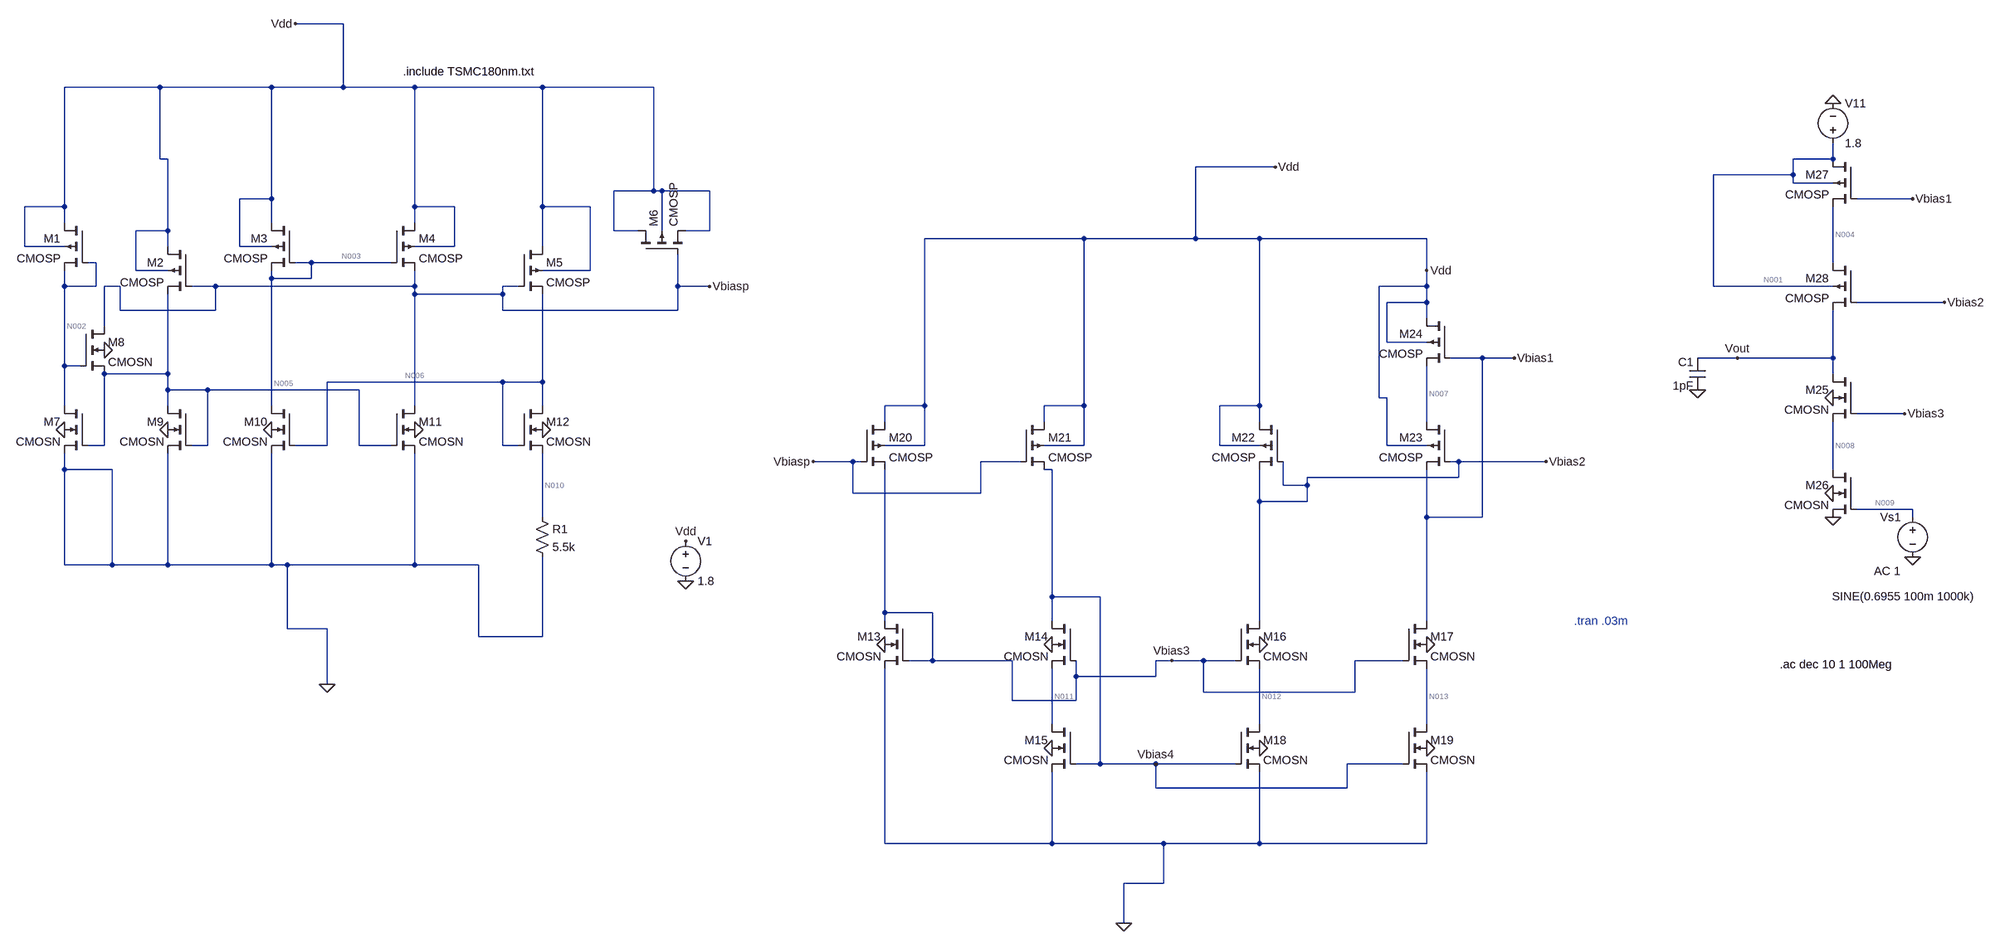
[diagram p0: schematic Project_LTSPICE_180nm.asc]
Project_LTSPICE_180nm.asc, the LTspice schematic file:
Version 4
SHEET 1 5252 1396
WIRE 96 -432 0 -432
WIRE -272 -304 -464 -304
WIRE -48 -304 -272 -304
WIRE 96 -304 96 -432
WIRE 96 -304 -48 -304
WIRE 240 -304 96 -304
WIRE 496 -304 240 -304
WIRE 720 -304 496 -304
WIRE -272 -160 -272 -304
WIRE -256 -160 -272 -160
WIRE 3088 -160 3088 -192
WIRE 3088 -160 3008 -160
WIRE 1968 -144 1808 -144
WIRE 3008 -128 3008 -160
WIRE 3008 -128 2848 -128
WIRE 3008 -112 3008 -128
WIRE 3088 -112 3008 -112
WIRE 720 -96 720 -304
WIRE 720 -96 640 -96
WIRE 736 -96 720 -96
WIRE 832 -96 736 -96
WIRE -48 -80 -48 -304
WIRE -48 -80 -112 -80
WIRE 3248 -80 3136 -80
WIRE -464 -64 -464 -304
WIRE -464 -64 -544 -64
WIRE 240 -64 240 -304
WIRE 320 -64 240 -64
WIRE 496 -64 496 -304
WIRE 592 -64 496 -64
WIRE -464 -32 -464 -64
WIRE -48 -32 -48 -80
WIRE 240 -32 240 -64
WIRE -256 -16 -256 -160
WIRE -256 -16 -320 -16
WIRE 640 -16 640 -96
WIRE 688 -16 640 -16
WIRE 736 -16 736 -96
WIRE 832 -16 832 -96
WIRE 832 -16 784 -16
WIRE 1584 0 1264 0
WIRE 1808 0 1808 -144
WIRE 1808 0 1584 0
WIRE 1936 0 1808 0
WIRE 2272 0 1936 0
WIRE -544 16 -544 -64
WIRE -464 16 -544 16
WIRE -256 16 -256 -16
WIRE -112 16 -112 -80
WIRE -48 16 -112 16
WIRE 320 16 320 -64
WIRE 320 16 240 16
WIRE 496 16 496 -64
WIRE -400 48 -416 48
WIRE 32 48 0 48
WIRE 192 48 32 48
WIRE 3088 48 3088 -64
WIRE -320 64 -320 -16
WIRE -256 64 -320 64
WIRE 592 64 592 -64
WIRE 592 64 496 64
WIRE 2272 64 2272 0
WIRE -48 80 -48 64
WIRE 32 80 32 48
WIRE 32 80 -48 80
WIRE -464 96 -464 64
WIRE -400 96 -400 48
WIRE -400 96 -464 96
WIRE -352 96 -384 96
WIRE -160 96 -208 96
WIRE 240 96 240 64
WIRE 240 96 -160 96
WIRE 448 96 416 96
WIRE 768 96 768 32
WIRE 832 96 768 96
WIRE 2272 96 2272 64
WIRE 2272 96 2176 96
WIRE 2848 96 2848 -128
WIRE 3088 96 2848 96
WIRE 240 112 240 96
WIRE 416 112 416 96
WIRE 416 112 240 112
WIRE 2272 128 2272 96
WIRE 2272 128 2192 128
WIRE 3312 128 3136 128
WIRE -352 144 -352 96
WIRE -160 144 -160 96
WIRE -160 144 -352 144
WIRE 416 144 416 112
WIRE 768 144 768 96
WIRE 768 144 416 144
WIRE 2272 160 2272 128
WIRE -384 176 -384 96
WIRE 2192 208 2192 128
WIRE 2272 208 2192 208
WIRE 2384 240 2320 240
WIRE 2448 240 2384 240
WIRE 2896 240 2816 240
WIRE 3088 240 3088 144
WIRE 3088 240 2896 240
WIRE -464 256 -464 96
WIRE -432 256 -464 256
WIRE -256 272 -256 112
WIRE -256 272 -384 272
WIRE 3088 272 3088 240
WIRE 416 288 64 288
WIRE 496 288 496 112
WIRE 496 288 416 288
WIRE -256 304 -256 272
WIRE -176 304 -256 304
WIRE 128 304 -176 304
WIRE 2176 320 2176 96
WIRE 2192 320 2176 320
WIRE -464 336 -464 256
WIRE -256 336 -256 304
WIRE -48 336 -48 80
WIRE 240 336 240 112
WIRE 496 336 496 288
WIRE 1264 336 1264 0
WIRE 1264 336 1184 336
WIRE 1584 336 1584 0
WIRE 1584 336 1504 336
WIRE 1936 336 1936 0
WIRE 1936 336 1856 336
WIRE 3232 352 3136 352
WIRE 1184 368 1184 336
WIRE 1504 368 1504 336
WIRE 1936 368 1936 336
WIRE 2272 368 2272 256
WIRE -384 416 -384 272
WIRE -384 416 -416 416
WIRE -176 416 -176 304
WIRE -176 416 -208 416
WIRE 64 416 64 288
WIRE 64 416 0 416
WIRE 128 416 128 304
WIRE 192 416 128 416
WIRE 416 416 416 288
WIRE 448 416 416 416
WIRE 1264 416 1264 336
WIRE 1264 416 1184 416
WIRE 1584 416 1584 336
WIRE 1584 416 1504 416
WIRE 1856 416 1856 336
WIRE 1936 416 1856 416
WIRE 2192 416 2192 320
WIRE 2272 416 2192 416
WIRE 1120 448 1040 448
WIRE 1136 448 1120 448
WIRE 1456 448 1376 448
WIRE 2336 448 2320 448
WIRE 2512 448 2336 448
WIRE -464 464 -464 432
WIRE -368 464 -464 464
WIRE 1520 464 1504 464
WIRE 3088 464 3088 368
WIRE 2336 480 2336 448
WIRE 2336 480 2032 480
WIRE 1984 496 1984 448
WIRE 2032 496 2032 480
WIRE 2032 496 1984 496
WIRE 1120 512 1120 448
WIRE 1376 512 1376 448
WIRE 1376 512 1120 512
WIRE 1936 528 1936 464
WIRE 2032 528 2032 496
WIRE 2032 528 1936 528
WIRE 3248 544 3136 544
WIRE 496 560 496 432
WIRE 2272 560 2272 464
WIRE 2384 560 2384 240
WIRE 2384 560 2272 560
WIRE 3248 560 3248 544
WIRE -464 656 -464 464
WIRE -368 656 -368 464
WIRE -368 656 -464 656
WIRE -256 656 -256 432
WIRE -256 656 -368 656
WIRE -48 656 -48 432
WIRE -48 656 -256 656
WIRE -16 656 -48 656
WIRE 240 656 240 432
WIRE 240 656 -16 656
WIRE 368 656 240 656
WIRE 1520 720 1520 464
WIRE 1616 720 1520 720
WIRE 1184 752 1184 464
WIRE 1280 752 1184 752
WIRE 1184 768 1184 752
WIRE 1520 768 1520 720
WIRE 1936 768 1936 528
WIRE 2272 768 2272 560
WIRE -16 784 -16 656
WIRE 64 784 -16 784
WIRE 368 800 368 656
WIRE 496 800 496 640
WIRE 496 800 368 800
WIRE 1280 848 1280 752
WIRE 1280 848 1232 848
WIRE 1440 848 1280 848
WIRE 1760 848 1728 848
WIRE 1824 848 1760 848
WIRE 1888 848 1824 848
WIRE 2224 848 2128 848
WIRE 1568 880 1568 848
WIRE 1728 880 1728 848
WIRE 1728 880 1568 880
WIRE 64 896 64 784
WIRE 1824 912 1824 848
WIRE 2128 912 2128 848
WIRE 2128 912 1824 912
WIRE 1440 928 1440 848
WIRE 1568 928 1568 880
WIRE 1568 928 1440 928
WIRE 1520 976 1520 864
WIRE 1936 976 1936 864
WIRE 2272 976 2272 864
WIRE 1616 1056 1616 720
WIRE 1616 1056 1568 1056
WIRE 1728 1056 1616 1056
WIRE 1888 1056 1728 1056
WIRE 2224 1056 2112 1056
WIRE 1728 1104 1728 1056
WIRE 2112 1104 2112 1056
WIRE 2112 1104 1728 1104
WIRE 1184 1216 1184 864
WIRE 1520 1216 1520 1072
WIRE 1520 1216 1184 1216
WIRE 1744 1216 1520 1216
WIRE 1936 1216 1936 1072
WIRE 1936 1216 1744 1216
WIRE 2272 1216 2272 1072
WIRE 2272 1216 1936 1216
WIRE 1744 1296 1744 1216
WIRE 1744 1296 1664 1296
WIRE 1664 1376 1664 1296
FLAG -464 384 0
FLAG -256 384 0
FLAG -48 384 0
FLAG 240 384 0
FLAG 496 384 0
FLAG -384 224 0
FLAG 1184 816 0
FLAG 1520 816 0
FLAG 1520 1024 0
FLAG 1936 816 0
FLAG 2272 816 0
FLAG 1936 1024 0
FLAG 2272 1024 0
FLAG 3088 -272 0
FLAG 3088 560 0
FLAG 3248 640 0
FLAG 2816 304 0
FLAG 2896 240 Vout
FLAG 3088 320 0
FLAG 3088 512 0
FLAG 2272 64 Vdd
FLAG 832 96 Vbiasp
FLAG 1040 448 Vbiasp
FLAG 1760 848 Vbias3
FLAG 1728 1056 Vbias4
FLAG 2448 240 Vbias1
FLAG 2512 448 Vbias2
FLAG 3248 -80 Vbias1
FLAG 3312 128 Vbias2
FLAG 3232 352 Vbias3
FLAG 784 688 0
FLAG 784 608 Vdd
FLAG 0 -432 Vdd
FLAG 1968 -144 Vdd
FLAG 1664 1376 0
FLAG 64 896 0
SYMBOL pmos4 -416 -32 M0
SYMATTR InstName M1
SYMATTR Value CMOSP
SYMATTR Value2 l=3600n w=1800n
SYMBOL pmos4 -208 16 M0
SYMATTR InstName M2
SYMATTR Value CMOSP
SYMATTR Value2 l=360n w=4320n
SYMBOL pmos4 0 -32 M0
SYMATTR InstName M3
SYMATTR Value CMOSP
SYMATTR Value2 l=360n w=4320n
SYMBOL pmos4 192 -32 R0
SYMATTR InstName M4
SYMATTR Value CMOSP
SYMATTR Value2 l=360n w=4320n
SYMBOL pmos4 448 16 R0
SYMATTR InstName M5
SYMATTR Value CMOSP
SYMATTR Value2 l=360n w=4320n
SYMBOL pmos4 688 32 R270
SYMATTR InstName M6
SYMATTR Value CMOSP
SYMATTR Value2 l=9000n w=9000n
SYMBOL nmos4 -416 336 M0
SYMATTR InstName M7
SYMATTR Value CMOSN
SYMATTR Value2 l=360n w=1800n
SYMBOL nmos4 -432 176 R0
SYMATTR InstName M8
SYMATTR Value CMOSN
SYMATTR Value2 l=360n w=720n
SYMBOL nmos4 -208 336 M0
SYMATTR InstName M9
SYMATTR Value CMOSN
SYMATTR Value2 l=360n w=1800n
SYMBOL nmos4 0 336 M0
SYMATTR InstName M10
SYMATTR Value CMOSN
SYMATTR Value2 l=360n w=1800n
SYMBOL nmos4 192 336 R0
SYMATTR InstName M11
SYMATTR Value CMOSN
SYMATTR Value2 l=360n w=1800n
SYMBOL nmos4 448 336 R0
SYMATTR InstName M12
SYMATTR Value CMOSN
SYMATTR Value2 l=360n w=5400n
SYMBOL res 480 544 R0
SYMATTR InstName R1
SYMATTR Value 5.5k
SYMBOL nmos4 1232 768 M0
SYMATTR InstName M13
SYMATTR Value CMOSN
SYMATTR Value2 l=1206n w=360n
SYMBOL nmos4 1568 768 M0
SYMATTR InstName M14
SYMATTR Value CMOSN
SYMATTR Value2 l=360n w=1800n
SYMBOL nmos4 1568 976 M0
SYMATTR InstName M15
SYMATTR Value CMOSN
SYMATTR Value2 l=360n w=1800n
SYMBOL nmos4 1888 768 R0
SYMATTR InstName M16
SYMATTR Value CMOSN
SYMATTR Value2 l=360n w=1980n
SYMBOL nmos4 2224 768 R0
SYMATTR InstName M17
SYMATTR Value CMOSN
SYMATTR Value2 l=360n w=1800n
SYMBOL nmos4 1888 976 R0
SYMATTR InstName M18
SYMATTR Value CMOSN
SYMATTR Value2 l=360n w=1800n
SYMBOL nmos4 2224 976 R0
SYMATTR InstName M19
SYMATTR Value CMOSN
SYMATTR Value2 l=360n w=1800n
SYMBOL pmos4 1136 368 R0
SYMATTR InstName M20
SYMATTR Value CMOSP
SYMATTR Value2 l=360n w=4320n
SYMBOL pmos4 1456 368 R0
SYMATTR InstName M21
SYMATTR Value CMOSP
SYMATTR Value2 l=360n w=4320n
SYMBOL pmos4 1984 368 M0
SYMATTR InstName M22
SYMATTR Value CMOSP
SYMATTR Value2 l=900n w=1190n
SYMBOL pmos4 2320 368 M0
SYMATTR InstName M23
SYMATTR Value CMOSP
SYMATTR Value2 l=360n w=3250n
SYMBOL pmos4 2320 160 M0
SYMATTR InstName M24
SYMATTR Value CMOSP
SYMATTR Value2 l=360n w=1710n
SYMBOL voltage 3088 -176 M180
WINDOW 0 24 96 Left 2
WINDOW 3 24 16 Left 2
WINDOW 123 0 0 Left 0
WINDOW 39 0 0 Left 0
SYMATTR InstName V11
SYMATTR Value 1.8
SYMBOL voltage 3248 544 M0
WINDOW 123 24 124 Left 2
WINDOW 39 0 0 Left 0
WINDOW 3 -125 175 Left 2
SYMATTR Value2 AC 1
SYMATTR Value SINE(0.6955 100m 1000k)
SYMATTR InstName Vs1
SYMBOL cap 2832 240 M0
SYMATTR InstName C1
SYMATTR Value 1pF
SYMBOL nmos4 3136 272 M0
SYMATTR InstName M25
SYMATTR Value CMOSN
SYMATTR Value2 l=180n w=807.84n
SYMBOL nmos4 3136 464 M0
SYMATTR InstName M26
SYMATTR Value CMOSN
SYMATTR Value2 l=180n w=807.84n
SYMBOL pmos4 3136 -160 M0
SYMATTR InstName M27
SYMATTR Value CMOSP
SYMATTR Value2 l=180n w=3991n
SYMBOL pmos4 3136 48 M0
SYMATTR InstName M28
SYMATTR Value CMOSP
SYMATTR Value2 l=180n w=3991n
SYMBOL voltage 784 592 R0
WINDOW 123 0 0 Left 0
WINDOW 39 0 0 Left 0
SYMATTR InstName V1
SYMATTR Value 1.8
TEXT 3208 856 Right 2 !.ac dec 10 1 100Meg
TEXT 2568 768 Left 2 ;.tran .03m
TEXT 216 -336 Left 2 !.include TSMC180nm.txt

The netlist it stands for:
* Project_LTSPICE_180nm.asc
M1 Vdd N002 N002 Vdd CMOSP l=3600n w=1800n
M2 Vdd Vbiasp N005 Vdd CMOSP l=360n w=4320n
M3 Vdd N003 N003 Vdd CMOSP l=360n w=4320n
M4 Vdd N003 Vbiasp Vdd CMOSP l=360n w=4320n
M5 Vdd Vbiasp N006 Vdd CMOSP l=360n w=4320n
M6 Vdd Vbiasp Vdd Vdd CMOSP l=9000n w=9000n
M7 N002 N005 0 0 CMOSN l=360n w=1800n
M8 Vbiasp N002 N005 0 CMOSN l=360n w=720n
M9 N005 N005 0 0 CMOSN l=360n w=1800n
M10 N003 N006 0 0 CMOSN l=360n w=1800n
M11 Vbiasp N005 0 0 CMOSN l=360n w=1800n
M12 N006 N006 N010 0 CMOSN l=360n w=5400n
R1 N010 0 5.5k
M13 Vbias3 Vbias3 0 0 CMOSN l=1206n w=360n
M14 Vbias4 Vbias3 N011 0 CMOSN l=360n w=1800n
M15 N011 Vbias4 0 0 CMOSN l=360n w=1800n
M16 Vbias2 Vbias3 N012 0 CMOSN l=360n w=1980n
M17 Vbias1 Vbias3 N013 0 CMOSN l=360n w=1800n
M18 N012 Vbias4 0 0 CMOSN l=360n w=1800n
M19 N013 Vbias4 0 0 CMOSN l=360n w=1800n
M20 Vdd Vbiasp Vbias3 Vdd CMOSP l=360n w=4320n
M21 Vdd Vbiasp Vbias4 Vdd CMOSP l=360n w=4320n
M22 Vdd Vbias2 Vbias2 Vdd CMOSP l=900n w=1190n
M23 N007 Vbias2 Vbias1 Vdd CMOSP l=360n w=3250n
M24 Vdd Vbias1 N007 Vdd CMOSP l=360n w=1710n
V11 N001 0 1.8
Vs1 N009 0 SINE(0.6955 100m 1000k) AC 1
C1 Vout 0 1pF
M25 Vout Vbias3 N008 0 CMOSN l=180n w=807.84n
M26 N008 N009 0 0 CMOSN l=180n w=807.84n
M27 N001 Vbias1 N004 N001 CMOSP l=180n w=3991n
M28 N004 Vbias2 Vout N001 CMOSP l=180n w=3991n
V1 Vdd 0 1.8
.model NMOS NMOS
.model PMOS PMOS
.lib standard.mos
.ac dec 10 1 100Meg
* .tran .03m
.include TSMC180nm.txt
.backanno
.end

* Results of the author's LTspice run, read from the files saved beside the schematic
* Operating Point, zero values left out:
*   V(vdd) = 1.8 V
*   V(n002) = 583.5 mV
*   V(vbiasp) = 1.223 V
*   V(n005) = 559.5 mV
*   V(n003) = 1.209 V
*   V(n006) = 559.8 mV
*   V(n010) = 44.12 mV
*   V(vbias3) = 864.9 mV
*   V(vbias4) = 564.6 mV
*   V(n011) = 239.2 mV
*   V(vbias2) = 911 mV
*   V(n012) = 246.9 mV
*   V(vbias1) = 1.121 V
*   V(n013) = 244.5 mV
*   V(n007) = 1.581 V
*   V(n001) = 1.8 V
*   V(n009) = 695.5 mV
*   V(vout) = 342.6 mV
*   V(n008) = 145.9 mV
*   V(n004) = 1.615 V
*   Id(M1) = 8.059 µA
*   Ib(M1) = 1.226 pA
*   Is(M1) = -8.059 µA
*   Id(M2) = 8.023 µA
*   Ib(M2) = 1.25 pA
*   Is(M2) = -8.023 µA
*   Id(M3) = 8.956 µA
*   Is(M3) = -8.956 µA
*   Id(M4) = 8.937 µA
*   Is(M4) = -8.937 µA
*   Id(M5) = 8.022 µA
*   Ib(M5) = 1.25 pA
*   Is(M5) = -8.022 µA
*   Id(M20) = 7.757 µA
*   Is(M20) = -7.757 µA
*   Id(M21) = 8.018 µA
*   Ib(M21) = 1.245 pA
*   Is(M21) = -8.018 µA
*   Id(M22) = 8.044 µA
*   Is(M22) = -8.044 µA
*   Id(M23) = 8.036 µA
*   Is(M23) = -8.036 µA
*   Id(M24) = 8.036 µA
*   Is(M24) = -8.036 µA
*   Id(M27) = 28.8 µA
*   Is(M27) = -28.8 µA
*   Id(M28) = 28.8 µA
*   Ib(M28) = 1.662 pA
*   Is(M28) = -28.8 µA
*   Id(M7) = 8.059 µA
*   Is(M7) = -8.059 µA
*   Id(M8) = 1.278 pA
*   Ib(M8) = -1.803 pA
*   Id(M9) = 8.023 µA
*   Is(M9) = -8.023 µA
*   Id(M10) = 8.956 µA
*   Ib(M10) = -1.219 pA
*   Is(M10) = -8.956 µA
*   Id(M11) = 8.937 µA
*   Ib(M11) = -1.233 pA
*   Is(M11) = -8.937 µA
*   Id(M12) = 8.022 µA
*   Is(M12) = -8.022 µA
*   Id(M13) = 7.757 µA
*   Is(M13) = -7.757 µA
*   Id(M14) = 8.018 µA
*   Is(M14) = -8.018 µA
*   Id(M15) = 8.018 µA
*   Is(M15) = -8.018 µA
*   Id(M16) = 8.044 µA
*   Ib(M16) = -1.178 pA
*   Is(M16) = -8.044 µA
*   Id(M17) = 8.036 µA
*   Ib(M17) = -1.385 pA
*   Is(M17) = -8.036 µA
*   Id(M18) = 8.044 µA
*   Is(M18) = -8.044 µA
*   Id(M19) = 8.036 µA
*   Is(M19) = -8.036 µA
*   Id(M25) = 28.8 µA
*   Is(M25) = -28.8 µA
*   Id(M26) = 28.8 µA
*   Is(M26) = -28.8 µA
*   I(R1) = 8.022 µA
*   I(V11) = -28.8 µA
*   I(V1) = -73.85 µA
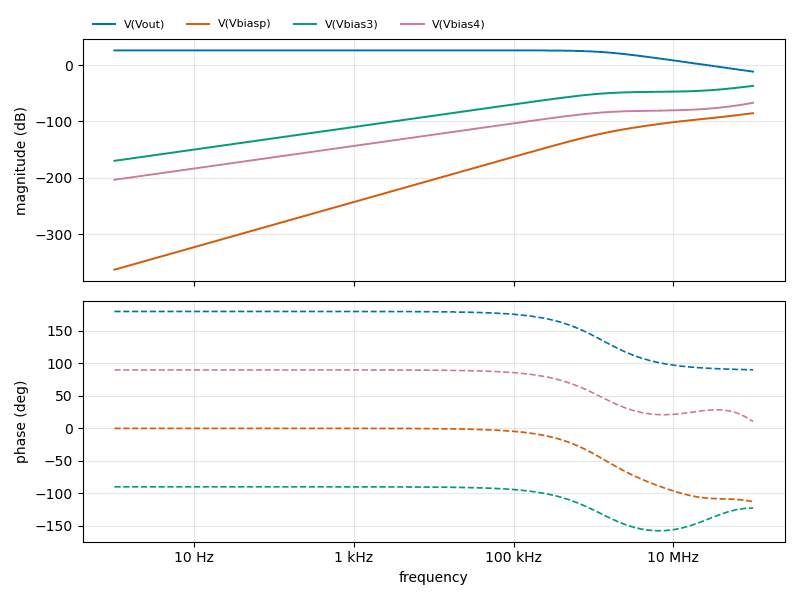
[diagram p1: AC Analysis of Project_LTSPICE_180nm.asc, plotted from the saved traces]
* AC Analysis, 1 run:
*   V(Vout): 25.98 dB at 1 Hz, -11.67 dB at 100 MHz, peak 25.98 dB at 1 Hz, 3 dB below the peak at 1.309 MHz
*   V(Vbiasp): -362.72 dB at 1 Hz, -85.29 dB at 100 MHz, peak -85.29 dB at 100 MHz, 3 dB below the peak at 67.5 MHz
*   V(Vbias3): -169.76 dB at 1 Hz, -36.90 dB at 100 MHz, peak -36.90 dB at 100 MHz, 3 dB below the peak at 65.94 MHz
*   V(Vbias4): -203.33 dB at 1 Hz, -66.86 dB at 100 MHz, peak -66.86 dB at 100 MHz, 3 dB below the peak at 75.14 MHz